# Altium schematic sheet Cell Characterization Board V1.1.SchDoc
size 431 x 279 mm; SheetNumber: 1; SheetTotal: 1
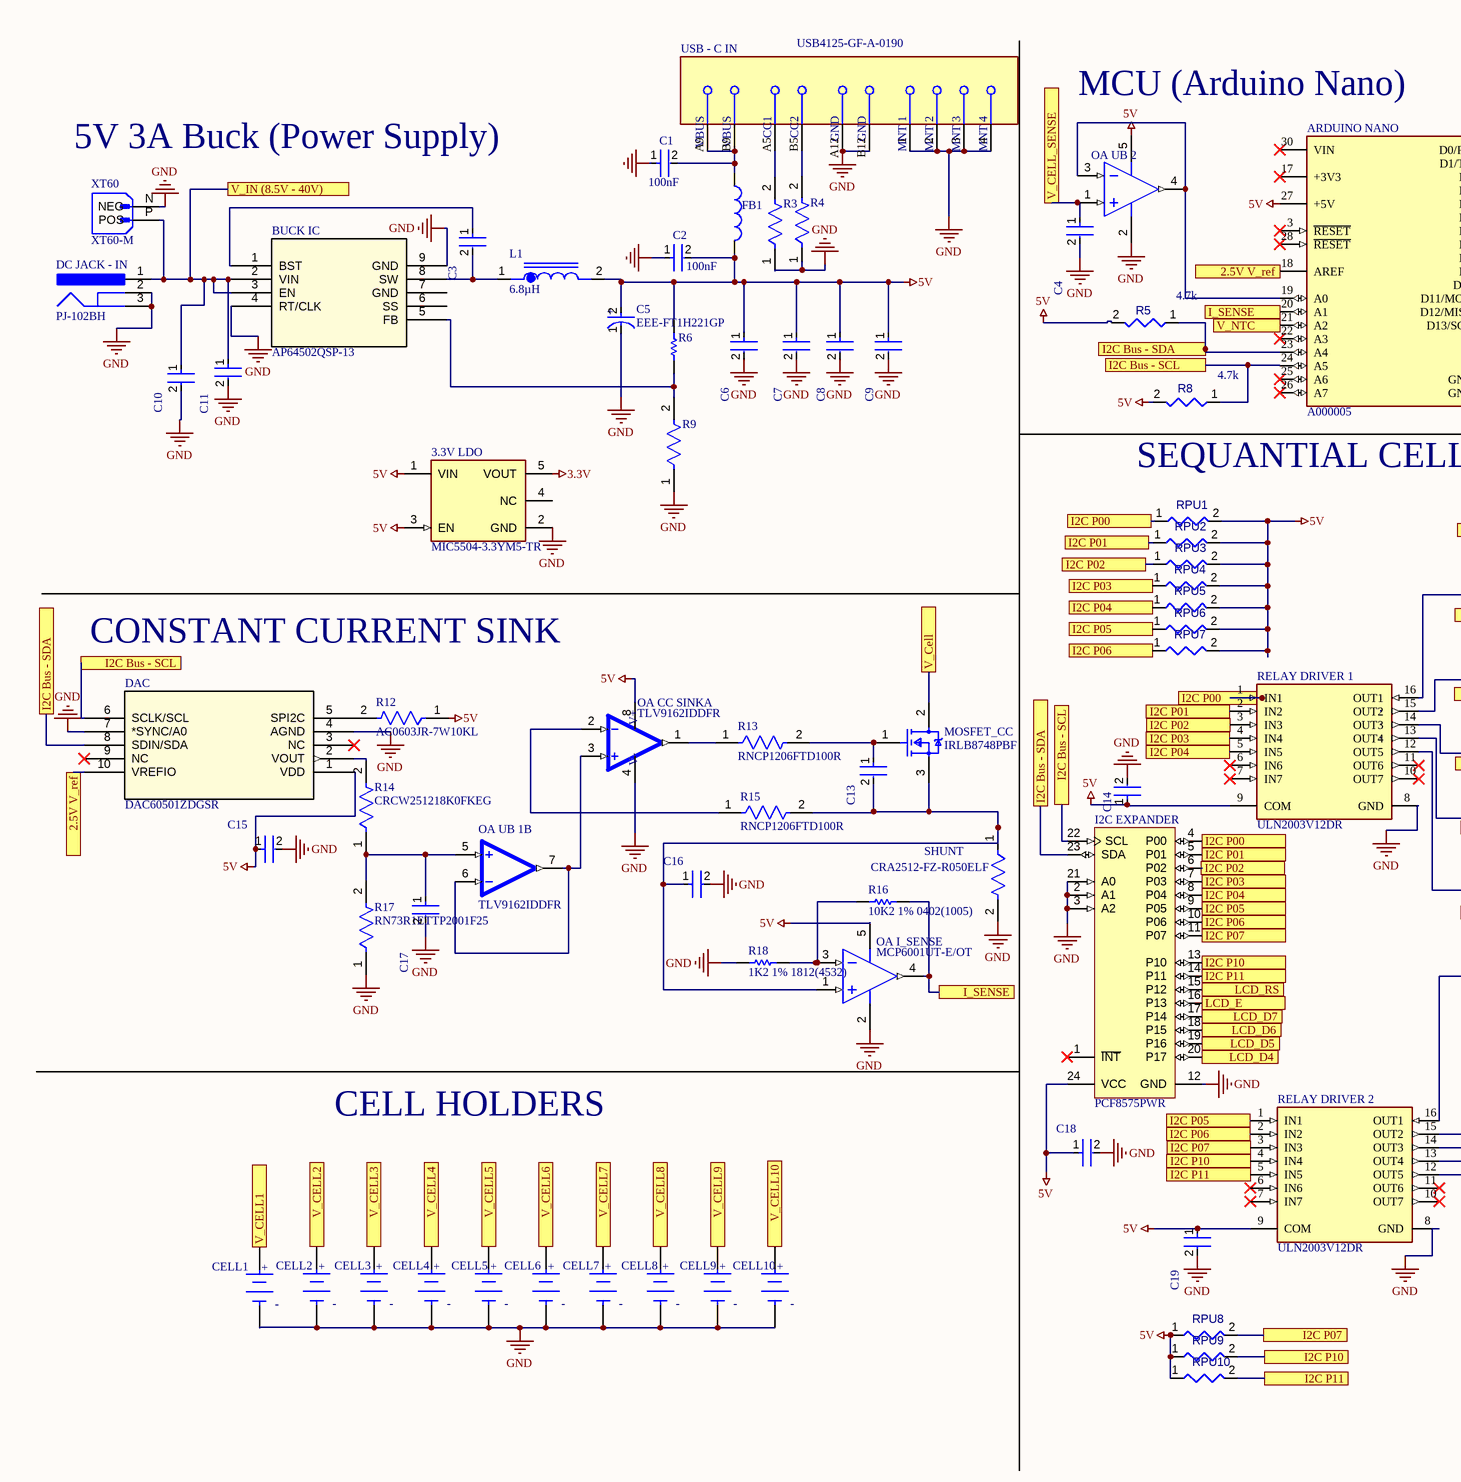
[diagram p0: Cell Characterization Board V1.1.SchDoc, top left]
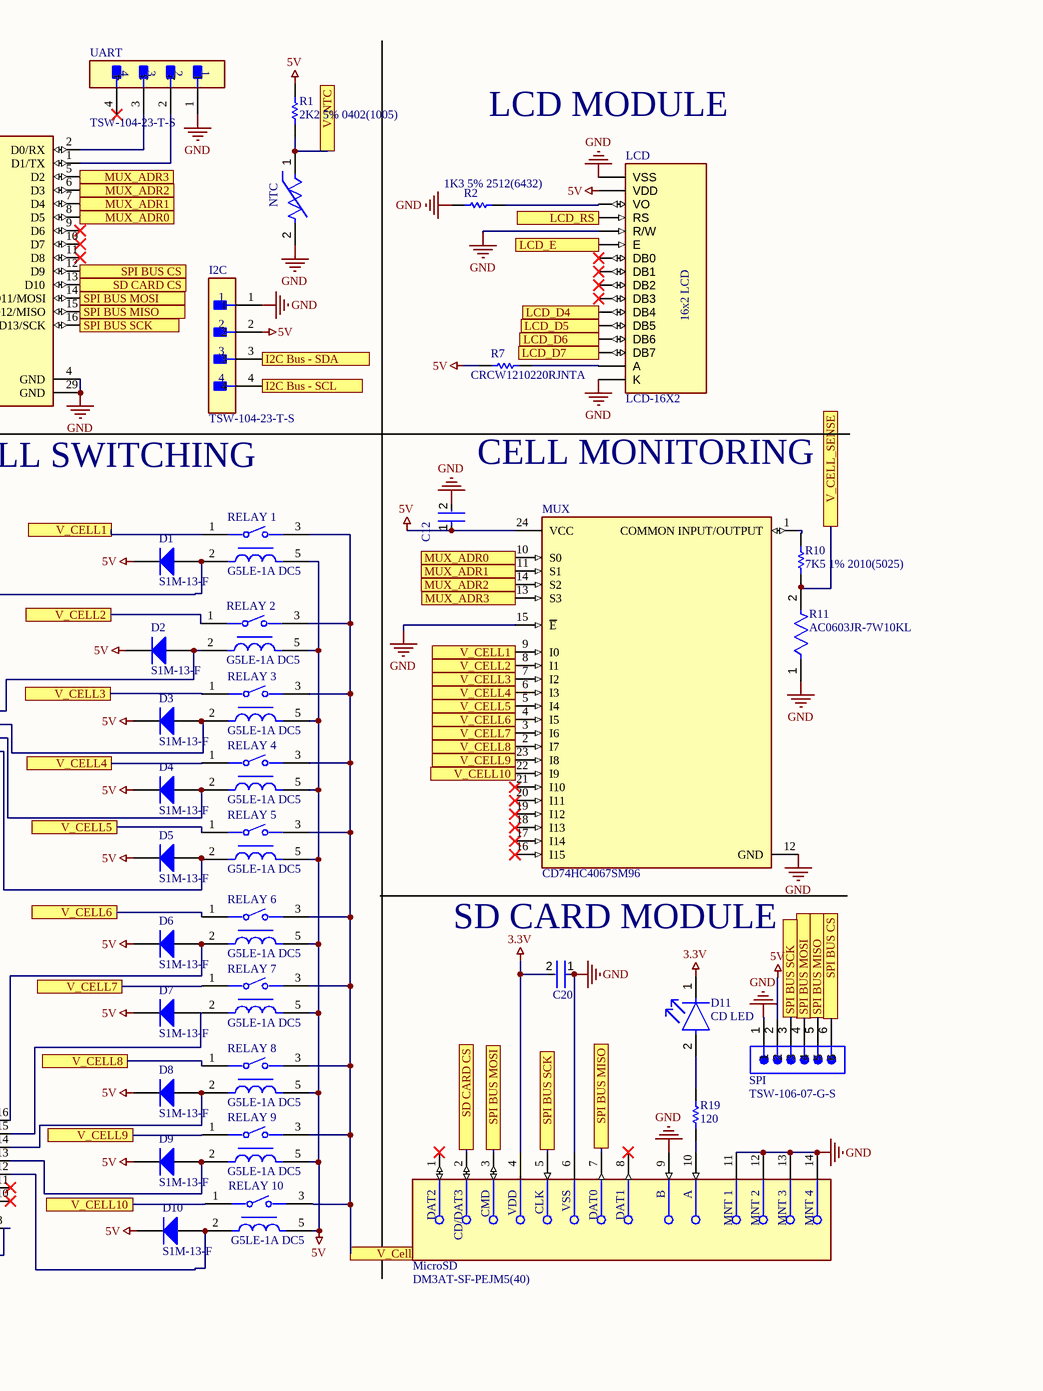
[diagram p1: Cell Characterization Board V1.1.SchDoc, top middle]

## Parts
3.3V_LDO  MIC5504-3.3YM5-TR  [FP-SOT23-5LD-PL-1-MFG]
ARDUINO_NANO  A000005  [FP-A000005-MFG]
BUCK_IC  AP64502QSP-13  [SO-8EP_DIO]
C1  100nF  [FP-CC0603-DA-MFG]
C2  100nF  [FP-CC0603-DA-MFG]
C3  CC0603KPX7R9BB104  [FP-CC0603-DA-MFG]  (value not drawn)
C4  CC0603KPX7R9BB104  [FP-CC0603-DA-MFG]  (value not drawn)
C5  EEE-FT1H221GP  [FP-FTF-MFG]
C6  GRM155R61H474KE11D  [FP-GRM155-0_1-IPC_B]  (value not drawn)
C7  GRM155R61H474KE11D  [FP-GRM155-0_1-IPC_B]  (value not drawn)
C8  GRM155R61H474KE11D  [FP-GRM155-0_1-IPC_B]  (value not drawn)
C9  GRM155R61H474KE11D  [FP-GRM155-0_1-IPC_B]  (value not drawn)
C10  CL31A106KBHNNNE  [FP-CL31-IPC_C]  (value not drawn)
C11  CL31A106KBHNNNE  [FP-CL31-IPC_C]  (value not drawn)
C12  CC0603KPX7R9BB104  [FP-CC0603-DA-MFG]  (value not drawn)
C13  C0402C103J3RACAUTO  [FP-C0402-BB-MFG]  (value not drawn)
C14  CC0603KPX7R9BB104  [FP-CC0603-DA-MFG]  (value not drawn)
C15  CC0603KPX7R9BB104  [FP-CC0603-DA-MFG]  (value not drawn)
C16  CC0603KPX7R9BB104  [FP-CC0603-DA-MFG]  (value not drawn)
C17  CC0603KPX7R9BB104  [FP-CC0603-DA-MFG]  (value not drawn)
C18  CC0603KPX7R9BB104  [FP-CC0603-DA-MFG]  (value not drawn)
C19  CC0603KPX7R9BB104  [FP-CC0603-DA-MFG]  (value not drawn)
C20  CC0603KPX7R9BB104  [FP-CC0603-DA-MFG]  (value not drawn)
CELL1  1042P  [FP-1042P-MFG]  (value not drawn)
CELL2  1042P  [FP-1042P-MFG]  (value not drawn)
CELL3  1042P  [FP-1042P-MFG]  (value not drawn)
CELL4  1042P  [FP-1042P-MFG]  (value not drawn)
CELL5  1042P  [FP-1042P-MFG]  (value not drawn)
CELL6  1042P  [FP-1042P-MFG]  (value not drawn)
CELL7  1042P  [FP-1042P-MFG]  (value not drawn)
CELL8  1042P  [FP-1042P-MFG]  (value not drawn)
CELL9  1042P  [FP-1042P-MFG]  (value not drawn)
CELL10  1042P  [FP-1042P-MFG]  (value not drawn)
D1  S1M-13-F  [DIOD-S1M-13-F-SMA-2_V]
D2  S1M-13-F  [DIOD-S1M-13-F-SMA-2_V]
D3  S1M-13-F  [DIOD-S1M-13-F-SMA-2_V]
D4  S1M-13-F  [DIOD-S1M-13-F-SMA-2_V]
D5  S1M-13-F  [DIOD-S1M-13-F-SMA-2_V]
D6  S1M-13-F  [DIOD-S1M-13-F-SMA-2_V]
D7  S1M-13-F  [DIOD-S1M-13-F-SMA-2_V]
D8  S1M-13-F  [DIOD-S1M-13-F-SMA-2_V]
D9  S1M-13-F  [DIOD-S1M-13-F-SMA-2_V]
D10  S1M-13-F  [DIOD-S1M-13-F-SMA-2_V]
D11  CD LED  [FP-LTST-C190GKT-MFG]
DAC  DAC60501ZDGSR  [DGS10_TEX]
DC_JACK_-_IN  PJ-102BH  [CUI-PJ-102BH_V]
FB1  74279252  [WE-CBF_1812_L4.5W3.2H1.5_HC]  (value not drawn)
I2C  TSW-104-23-T-S  [FP-TSW-104-23-T-S-MFG]
I2C_EXPANDER  PCF8575PWR  [PW0024A_L]
L1  value 6.8µH  [IND_MGAH06036R8M-10]  (hidden comment: MGAH06036R8M-10)
LCD  LCD-16X2  [MODULE_LCD-16X2]
MicroSD  DM3AT-SF-PEJM5(40)  [FP-DM3AT-SF-PEJM5_40-MFG]
MOSFET_CC  IRLB8748PBF  [FP-PG-TO220-3-MFG]
MUX  CD74HC4067SM96  [FP-DB0024A-IPC_C]
NTC  NXRT15XH103FA1B030  [FP-NXR_151B030-MFG]  (value not drawn)
OA_CC_SINK  TLV9162IDDFR  [SOT65P280X110-8N]  (part A of 2)
OA_I_SENSE  MCP6001UT-E/OT  [SOT-23-OT5_L]
OA_UB_1  TLV9162IDDFR  [SOT65P280X110-8N]  (part B of 2)
OA_UB_2  MCP6001UT-E/OT  [SOT-23-OT5_L]  (value not drawn)
R1  2K2 5% 0402(1005)  [RESC0402(1005)_N]
R2  1K3 5% 2512(6432)  [RESC2512(6432)_M]
R3  CPF0603B10K7E  [FP-CPF0603-MFG]  (value not drawn)
R4  CPF0603B10K7E  [FP-CPF0603-MFG]  (value not drawn)
R5  value 4.7k  [RESC1005X40X25ML05T05]  (hidden comment: Resistor 4k7 +/-1% 0402 100 mW)
R6  523K 1% 0805(2012)  [RESC0805(2012)_L]  (value not drawn)
R7  CRCW1210220RJNTA  [RESC3225X60X45NL20T20]
R8  value 4.7k  [RESC1005X40X25ML05T05]  (hidden comment: Resistor 4k7 +/-1% 0402 100 mW)
R9  AC0603JR-7W10KL  [FP-AC0603-IPC_A]  (value not drawn)
R10  7K5 1% 2010(5025)  [RESC2010(5025)_M]
R11  AC0603JR-7W10KL  [FP-AC0603-IPC_A]
R12  AC0603JR-7W10KL  [FP-AC0603-IPC_A]
R13  RNCP1206FTD100R  [FP-RNCP1206-IPC_C]
R14  CRCW251218K0FKEG  [FP-CRCW2512-e3-MFG]
R15  RNCP1206FTD100R  [FP-RNCP1206-IPC_C]
R16  10K2 1% 0402(1005)  [RESC0402(1005)_N]
R17  RN73R1ETTP2001F25  [FP-RN73R1E-IPC_B]
R18  1K2 1% 1812(4532)  [RESC1812(4532)_L]
R19  120  [RESC3225X60X45NL20T20]
RELAY_1  G5LE-1A DC5  [FP-G5LE-1A_DC5-MFG]
RELAY_2  G5LE-1A DC5  [FP-G5LE-1A_DC5-MFG]
RELAY_3  G5LE-1A DC5  [FP-G5LE-1A_DC5-MFG]
RELAY_4  G5LE-1A DC5  [FP-G5LE-1A_DC5-MFG]
RELAY_5  G5LE-1A DC5  [FP-G5LE-1A_DC5-MFG]
RELAY_6  G5LE-1A DC5  [FP-G5LE-1A_DC5-MFG]
RELAY_7  G5LE-1A DC5  [FP-G5LE-1A_DC5-MFG]
RELAY_8  G5LE-1A DC5  [FP-G5LE-1A_DC5-MFG]
RELAY_9  G5LE-1A DC5  [FP-G5LE-1A_DC5-MFG]
RELAY_10  G5LE-1A DC5  [FP-G5LE-1A_DC5-MFG]
RELAY_DRIVER_1  ULN2003V12DR  [FP-D0016A-MFG]
RELAY_DRIVER_2  ULN2003V12DR  [FP-D0016A-MFG]
RPU1  Resistor 4k7 +/-1% 0402 100 mW  [RESC1005X40X25ML05T05]  (value not drawn)
RPU2  Resistor 4k7 +/-1% 0402 100 mW  [RESC1005X40X25ML05T05]  (value not drawn)
RPU3  Resistor 4k7 +/-1% 0402 100 mW  [RESC1005X40X25ML05T05]  (value not drawn)
RPU4  Resistor 4k7 +/-1% 0402 100 mW  [RESC1005X40X25ML05T05]  (value not drawn)
RPU5  Resistor 4k7 +/-1% 0402 100 mW  [RESC1005X40X25ML05T05]  (value not drawn)
RPU6  Resistor 4k7 +/-1% 0402 100 mW  [RESC1005X40X25ML05T05]  (value not drawn)
RPU7  Resistor 4k7 +/-1% 0402 100 mW  [RESC1005X40X25ML05T05]  (value not drawn)
RPU8  Resistor 4k7 +/-1% 0402 100 mW  [RESC1005X40X25ML05T05]  (value not drawn)
RPU9  Resistor 4k7 +/-1% 0402 100 mW  [RESC1005X40X25ML05T05]  (value not drawn)
RPU10  Resistor 4k7 +/-1% 0402 100 mW  [RESC1005X40X25ML05T05]  (value not drawn)
SHUNT  CRA2512-FZ-R050ELF  [FP-CRA2512-IPC_A]
SPI  TSW-106-07-G-S  [SMTC-TSW-106-07-X-S]
UART  TSW-104-23-T-S  [FP-TSW-104-23-T-S-MFG]
USB_-_C_IN  USB4125-GF-A-0190  [FP-USB4125-GF-A-0190-MFG]
XT60  XT60-M  [AMASS_XT60-M]

## Ports
2.5V V_ref, I2C Bus - SCL, I2C Bus - SDA, I2C P00, I2C P01, I2C P02, I2C P03, I2C P04, I2C P05, I2C P06, I2C P07, I2C P10, I2C P11, I_SENSE, LCD_D4, LCD_D5, LCD_D6, LCD_D7, LCD_E, LCD_RS, MUX_ADR0, MUX_ADR1, MUX_ADR2, MUX_ADR3, SD CARD CS, SPI BUS CS, SPI BUS MISO, SPI BUS MOSI, SPI BUS SCK, V_Cell, V_CELL1, V_CELL2, V_CELL3, V_CELL4, V_CELL5, V_CELL6, V_CELL7, V_CELL8, V_CELL9, V_CELL10, V_CELL_SENSE, V_IN (8.5V - 40V), V_NTC

## Nets
3.3V: 3.3V_LDO.5(VOUT) C20.2 D11.1(C) MicroSD.4(VDD)
5V: 3.3V_LDO.1(VIN) 3.3V_LDO.3(EN) ARDUINO_NANO.27(+5V) C2.2 C5.2(A) C6.1 C7.1 C8.1 C9.1 C12.1 C14.1 C15.1 C18.1 C19.1 D1.2(K) D2.2(K) D3.2(K) D4.2(K) D5.2(K) D6.2(K) D7.2(K) D8.2(K) D9.2(K) D10.2(K) DAC.1(VDD) FB1.2 I2C.2 I2C_EXPANDER.24(VCC) L1.2 LCD.2(VDD) MUX.24(VCC) OA_CC_SINK.8(V+) OA_I_SENSE.5(VDD) OA_UB_2.5(VDD) R1.2 R5.2 R6.2 R7.1 R8.2 R12.1 RELAY_1.5 RELAY_2.5 RELAY_3.5 RELAY_4.5 RELAY_5.5 RELAY_6.5 RELAY_7.5 RELAY_8.5 RELAY_9.5 RELAY_10.5 RELAY_DRIVER_1.9(COM) RELAY_DRIVER_2.9(COM) RPU1.2 RPU2.2 RPU3.2 RPU4.2 RPU5.2 RPU6.2 RPU7.2 RPU8.1 RPU9.1 RPU10.1 SPI.2
GND: 3.3V_LDO.2(GND) ARDUINO_NANO.4(GND) ARDUINO_NANO.29(GND) BUCK_IC.4(RT/CLK) BUCK_IC.9(GND) C1.1 C2.1 C4.2 C5.1(C) C6.2 C7.2 C8.2 C9.2 C10.2 C11.2 C12.2 C14.2 C15.2 C16.2 C17.2 C18.2 C19.2 C20.1 CELL1.1(C) CELL2.1(C) CELL3.1(C) CELL4.1(C) CELL5.1(C) CELL6.1(C) CELL7.1(C) CELL8.1(C) CELL9.1(C) CELL10.1(C) DAC.4(AGND) DAC.7(*SYNC/A0) DC_JACK_-_IN.2 DC_JACK_-_IN.3 I2C.1 I2C_EXPANDER.2(A1) I2C_EXPANDER.3(A2) I2C_EXPANDER.12(GND) I2C_EXPANDER.21(A0) LCD.1(VSS) LCD.5(R/W) LCD.16(K) MicroSD.6(VSS) MicroSD.9(B) MicroSD.11(MNT_1) MicroSD.12(MNT_2) MicroSD.13(MNT_3) MicroSD.14(MNT_4) MUX.12(GND) MUX.15(~{E}) NTC.2 OA_CC_SINK.4(V-) OA_I_SENSE.2(VSS) OA_UB_2.2(VSS) R2.1 R3.1 R4.1 R9.1 R11.1 R17.1 R18.1 RELAY_DRIVER_1.8(GND) RELAY_DRIVER_2.8(GND) SHUNT.2 SPI.1 UART.1 USB_-_C_IN.1(MNT_1) USB_-_C_IN.2(MNT_2) USB_-_C_IN.3(MNT_3) USB_-_C_IN.4(MNT_4) USB_-_C_IN.A12(GND) USB_-_C_IN.B12(GND) XT60.N(NEG)
2.5V V_ref: ARDUINO_NANO.18(AREF) DAC.10(VREFIO) ; port 2.5V V_ref
I2C Bus - SCL: ARDUINO_NANO.24(A5) DAC.6(SCLK/SCL) I2C.4 I2C_EXPANDER.22(SCL) R8.1 ; port I2C Bus - SCL
I2C Bus - SDA: ARDUINO_NANO.23(A4) DAC.8(SDIN/SDA) I2C.3 I2C_EXPANDER.23(SDA) R5.1 ; port I2C Bus - SDA
I2C P00: I2C_EXPANDER.4(P00) RELAY_DRIVER_1.1(IN1) RPU1.1 ; port I2C P00
I2C P01: I2C_EXPANDER.5(P01) RELAY_DRIVER_1.2(IN2) RPU2.1 ; port I2C P01
I2C P02: I2C_EXPANDER.6(P02) RELAY_DRIVER_1.3(IN3) RPU3.1 ; port I2C P02
I2C P03: I2C_EXPANDER.7(P03) RELAY_DRIVER_1.4(IN4) RPU4.1 ; port I2C P03
I2C P04: I2C_EXPANDER.8(P04) RELAY_DRIVER_1.5(IN5) RPU5.1 ; port I2C P04
I2C P05: I2C_EXPANDER.9(P05) RELAY_DRIVER_2.1(IN1) RPU6.1 ; port I2C P05
I2C P06: I2C_EXPANDER.10(P06) RELAY_DRIVER_2.2(IN2) RPU7.1 ; port I2C P06
I2C P07: I2C_EXPANDER.11(P07) RELAY_DRIVER_2.3(IN3) RPU8.2 ; port I2C P07
I2C P10: I2C_EXPANDER.13(P10) RELAY_DRIVER_2.4(IN4) RPU9.2 ; port I2C P10
I2C P11: I2C_EXPANDER.14(P11) RELAY_DRIVER_2.5(IN5) RPU10.2 ; port I2C P11
I_SENSE: ARDUINO_NANO.20(A1) OA_I_SENSE.4(VOUT) R16.2 ; port I_SENSE
LCD_D4: I2C_EXPANDER.20(P17) LCD.11(DB4) ; port LCD_D4
LCD_D5: I2C_EXPANDER.19(P16) LCD.12(DB5) ; port LCD_D5
LCD_D6: I2C_EXPANDER.18(P15) LCD.13(DB6) ; port LCD_D6
LCD_D7: I2C_EXPANDER.17(P14) LCD.14(DB7) ; port LCD_D7
LCD_E: I2C_EXPANDER.16(P13) LCD.6(E) ; port LCD_E
LCD_RS: I2C_EXPANDER.15(P12) LCD.4(RS) ; port LCD_RS
MUX_ADR0: ARDUINO_NANO.8(D5) MUX.10(S0) ; port MUX_ADR0
MUX_ADR1: ARDUINO_NANO.7(D4) MUX.11(S1) ; port MUX_ADR1
MUX_ADR2: ARDUINO_NANO.6(D3) MUX.14(S2) ; port MUX_ADR2
MUX_ADR3: ARDUINO_NANO.5(D2) MUX.13(S3) ; port MUX_ADR3
SD CARD CS: ARDUINO_NANO.13(D10) MicroSD.2(CD/DAT3) ; port SD CARD CS
SPI BUS CS: ARDUINO_NANO.12(D9) SPI.6 ; port SPI BUS CS
SPI BUS MISO: ARDUINO_NANO.15(D12/MISO) MicroSD.7(DAT0) SPI.5 ; port SPI BUS MISO
SPI BUS MOSI: ARDUINO_NANO.14(D11/MOSI) MicroSD.3(CMD) SPI.4 ; port SPI BUS MOSI
SPI BUS SCK: ARDUINO_NANO.16(D13/SCK) MicroSD.5(CLK) SPI.3 ; port SPI BUS SCK
V_Cell: MOSFET_CC.2(D) RELAY_1.3 RELAY_2.3 RELAY_3.3 RELAY_4.3 RELAY_5.3 RELAY_6.3 RELAY_7.3 RELAY_8.3 RELAY_9.3 RELAY_10.3 ; port V_Cell
V_CELL1: CELL1.2(A) MUX.9(I0) RELAY_1.1 ; port V_CELL1
V_CELL2: CELL2.2(A) MUX.8(I1) RELAY_2.1 ; port V_CELL2
V_CELL3: CELL3.2(A) MUX.7(I2) RELAY_3.1 ; port V_CELL3
V_CELL4: CELL4.2(A) MUX.6(I3) RELAY_4.1 ; port V_CELL4
V_CELL5: CELL5.2(A) MUX.5(I4) RELAY_5.1 ; port V_CELL5
V_CELL6: CELL6.2(A) MUX.4(I5) RELAY_6.1 ; port V_CELL6
V_CELL7: CELL7.2(A) MUX.3(I6) RELAY_7.1 ; port V_CELL7
V_CELL8: CELL8.2(A) MUX.2(I7) RELAY_8.1 ; port V_CELL8
V_CELL9: CELL9.2(A) MUX.23(I8) RELAY_9.1 ; port V_CELL9
V_CELL10: CELL10.2(A) MUX.22(I9) RELAY_10.1 ; port V_CELL10
V_CELL_SENSE: C4.1 OA_UB_2.1(VIN+) R10.1 R11.2 ; port V_CELL_SENSE
V_IN (8.5V - 40V): BUCK_IC.2(VIN) BUCK_IC.3(EN) C10.1 C11.1 DC_JACK_-_IN.1 XT60.P(POS) ; port V_IN (8.5V - 40V)
V_NTC: ARDUINO_NANO.21(A2) NTC.1 R1.1 ; port V_NTC
NetARDUINO_NANO_1: ARDUINO_NANO.1(D1/TX) UART.2
NetARDUINO_NANO_2: ARDUINO_NANO.2(D0/RX) UART.3
NetARDUINO_NANO_19: ARDUINO_NANO.19(A0) OA_UB_2.3(VIN-) OA_UB_2.4(VOUT)
NetBUCK_IC_1: BUCK_IC.1(BST) C3.1
NetBUCK_IC_5: BUCK_IC.5(FB) R6.1 R9.2
NetBUCK_IC_8: BUCK_IC.8(SW) C3.2 L1.1
NetC1_2: C1.2 FB1.1 USB_-_C_IN.A9(VBUS) USB_-_C_IN.B9(VBUS)
NetC13_1: C13.1 MOSFET_CC.1(G) R13.2
NetC13_2: C13.2 C16.1 MOSFET_CC.3(S) OA_I_SENSE.1(VIN+) R15.2 SHUNT.1
NetC17_1: C17.1 OA_UB_1.5(IN2+) R14.1 R17.2
NetD1_1: D1.1(A) RELAY_1.2 RELAY_DRIVER_1.16(OUT1)
NetD2_1: D2.1(A) RELAY_2.2 RELAY_DRIVER_1.15(OUT2)
NetD3_1: D3.1(A) RELAY_3.2 RELAY_DRIVER_1.14(OUT3)
NetD4_1: D4.1(A) RELAY_4.2 RELAY_DRIVER_1.13(OUT4)
NetD5_1: D5.1(A) RELAY_5.2 RELAY_DRIVER_1.12(OUT5)
NetD6_1: D6.1(A) RELAY_6.2 RELAY_DRIVER_2.16(OUT1)
NetD7_1: D7.1(A) RELAY_7.2 RELAY_DRIVER_2.15(OUT2)
NetD8_1: D8.1(A) RELAY_8.2 RELAY_DRIVER_2.14(OUT3)
NetD9_1: D9.1(A) RELAY_9.2 RELAY_DRIVER_2.13(OUT4)
NetD10_1: D10.1(A) RELAY_10.2 RELAY_DRIVER_2.12(OUT5)
NetD11_2: D11.2(A) R19.2
NetDAC_2: DAC.2(VOUT) R14.2
NetDAC_5: DAC.5(SPI2C) R12.2
NetLCD_3: LCD.3(VO) R2.2
NetLCD_15: LCD.15(A) R7.2
NetMicroSD_10: MicroSD.10(A) R19.1
NetMUX_1: MUX.1(COMMON_INPUT/OUTPUT) R10.2
NetOA_CC_SINK_1: OA_CC_SINK.1(OUT1) R13.1
NetOA_CC_SINK_2: OA_CC_SINK.2(IN1-) R15.1
NetOA_CC_SINK_3: OA_CC_SINK.3(IN1+) OA_UB_1.6(IN2-) OA_UB_1.7(OUT2)
NetOA_I_SENSE_3: OA_I_SENSE.3(VIN-) R16.1 R18.2
NetR3_2: R3.2 USB_-_C_IN.A5(CC1)
NetR4_2: R4.2 USB_-_C_IN.B5(CC2)

Not connected (* = marked no-connect by the designer): 3.3V_LDO 4(NC); ARDUINO_NANO 3(~{RESET})* 9(D6)* 10(D7)* 11(D8)* 17(+3V3)* 22(A3)* 25(A6)* 26(A7)* 28(~{RESET})* 30(VIN)*; BUCK_IC 6(SS) 7(GND); DAC 3(NC)* 9(NC)*; I2C_EXPANDER 1(~{INT})*; LCD 7(DB0)* 8(DB1)* 9(DB2)* 10(DB3)*; MicroSD 1(DAT2)* 8(DAT1)*; MUX 16(I15)* 17(I14)* 18(I13)* 19(I12)* 20(I11)* 21(I10)*; RELAY_DRIVER_1 6(IN6)* 7(IN7)* 10(OUT7)* 11(OUT6)*; RELAY_DRIVER_2 6(IN6)* 7(IN7)* 10(OUT7)* 11(OUT6)*; UART 4*

## Notes on the sheet
- MCU (Arduino Nano)
- (near XT60) 5V 3A Buck (Power Supply)
- LCD MODULE
- SEQUANTIAL CELL SWITCHING
- CELL MONITORING
- CONSTANT CURRENT SINK
- SD CARD MODULE
- CELL HOLDERS
- DWG. NO.
- REV.
- SHT.
- THIS DOCUMENT AND THE DATA DISCLOSED HEREIN OR HEREWITH IS THE PROPERTY OF ALTIUM LIMITED AND MAY BE FREELY DISTRIBUTED IN WHOLE. NO RIGHTS ARE RESERVED OR EXPRESS OR IMPLIED WARANTEE GIVEN.
- REVISION
- DESCRIPTION
- DATE
- APPROVED
- ENG:
- APPROVALS
- PROJECT
- DSN:
- CHK:
- REFERENCE DOCUMENTS
- PROJECT REVISION:
- TITLE
- DOCUMENT REVISION:
- DESIGN ITEM:
- BOM:
- FAB DWG:
- PCB DWG:
- ASSY DWG:
- SCALE:
- SIZE
- B
- CAGE CODE
- FILE NAME
- DWG NO.
- SHEET
- OF
- REV
- (in symbol CMP-008-000000-1) 16x2 LCD
- (in symbol CMP-05427-002180-1) +
- (in symbol CMP-19636-000019-1) +; -

## Library data of the parts
3.3V_LDO = CMP-2000-07604-2: IC REG LINEAR 3.3V 300MA SOT23-5; Quiescent Current: 38uA; Operating Supply Current: 42uA; Max Input Voltage: 5.5V; Min Input Voltage: 2.5V; Output Type: Fixed; Power Supply Rejection Ratio (PSRR): 60dB; Dropout Voltage: 380mV; Accuracy: 3%; Number of Outputs: 1; Nominal Output Voltage: 3.3V; Max Output Current: 300mA; Length: 2.9mm; Mount: Surface Mount; Width: 1.6mm; Packaging: Tape and Reel; Output Current: 300mA; Min Operating Temperature: -40°C; Max Operating Temperature: 125°C; Height: 1.1mm; Case/Package: SOT-23-5; REACH SVHC: No SVHC; Number of Pins: 5; Output Voltage: 3.3V
ARDUINO_NANO = CMP-189986-000002-1: ARDUINO NANO ATMEGA328 EVAL BRD; Number of Bits: 8; Evaluation Kit: Yes; Operating Supply Voltage: 12V; Interface: I2C; Data Bus Width: 8b; Core Architecture: AVR; Packaging: Bulk; Length: 7inch; Package Quantity: 50; Width: 5inch; REACH SVHC: No SVHC; Weight: 0.358383oz; Series: AVR® ATmega; Height: 0.25inch
BUCK_IC = AP64502QSP-13: Description; Manufacturer_Name: Diodes Inc; Copyright: Copyright (C) 2025 Ultra Librarian. All rights reserved.; Manufacturer_Part_Number: AP64502QSP-13; RefDes: RefDes; Type: Type
C1 C2 = CMP-03422-000468-1: CAP CER 0.1UF 50V X7R 0603; Manufacturer: YAGEO; Manufacturer Part Number: CC0603KPX7R9BB104; Temperature Coefficient: 15%; Material: Ceramic; Tolerance: 0.1; Device Class L1: Passive Components; Temperature Range High: +125°C; ComponentLink2Description: Datasheet; Temperature Characteristic: X7R; Octopart: https://octopart.com/cc0603kpx7r9bb104-yageo-12885113; Height: 0.9mm; Mouser Description: Multilayer Ceramic Capacitors MLCC - SMD/SMT 100nF 50V X7R 10%; Device Class L3: Ceramic Capacitors; Voltage Rating: 50 V; Device Class L2: Capacitors; ComponentLink2URL: http://www.yageo.com/documents/recent/UPY-GPHC_X7R_6.3V-to-50V_18.pdf; Package: CC0603-DA; Automotive: No; Capacitance: 100 nF; Voltage: 50 V; RoHS: TRUE; Lead Free: Yes; Digikey Description: CAP CER 0.1UF 50V X7R 0603; Footprint Url: http://www.yageo.com/exep/pages/download/literatures/UPY-C_GEN_24.pdf; Temperature Range Low: -55°C; Temperature: -55°C to +125°C; Value: 100 nF; Category: Cap
C3 C4 C12 C14-C20 = CMP-03422-000468-1: CAP CER 0.1UF 50V X7R 0603; Manufacturer: YAGEO; Temperature Coefficient: 15%; Capacitance: 100 nF; Material: Ceramic; Value: 100 nF; Tolerance: 0.1; Device Class L1: Passive Components; Temperature Range High: +125°C; ComponentLink2Description: Datasheet; Temperature Characteristic: X7R; Octopart: https://octopart.com/cc0603kpx7r9bb104-yageo-12885113; Height: 0.9mm; Mouser Description: Multilayer Ceramic Capacitors MLCC - SMD/SMT 100nF 50V X7R 10%; Device Class L3: Ceramic Capacitors; Voltage Rating: 50 V; Device Class L2: Capacitors; ComponentLink2URL: http://www.yageo.com/documents/recent/UPY-GPHC_X7R_6.3V-to-50V_18.pdf; Package: CC0603-DA; Manufacturer Part Number: CC0603KPX7R9BB104; Automotive: No; Voltage: 50 V; RoHS: TRUE; Lead Free: Yes; Digikey Description: CAP CER 0.1UF 50V X7R 0603; Footprint Url: http://www.yageo.com/exep/pages/download/literatures/UPY-C_GEN_24.pdf; Temperature Range Low: -55°C; Temperature: -55°C to +125°C; Category: Cap
C5 = CMP-05427-002180-1: CAP ALUM 220UF 20% 50V SMD; Ripple Current: 435.5mA; Polarity: Polar; ESR (Equivalent Series Resistance): 180mR; Ripple Current (AC): 670mA; Life (Hours): 5000Hour; Mount: Surface Mount; Height: 10.2mm; Voltage Rating: 50V; RoHS Compliant: Yes; Packaging: Cut Tape; Capacitance: 220uF; Height - Seated (Max): 0.413inch; Tolerance: 20%; Diameter: 8mm; Case/Package: Radial; Max Operating Temperature: 105°C; Min Operating Temperature: -55°C; Voltage Rating (DC): 50V; Reach SVHC Compliant: Yes
C6-C9 = CMP-06035-008741-1: Chip Multilayer Ceramic Capacitors for General Purpose, 0402, 0.47uF, X5R, 15%, 10%, 50V; Capacitance: 470nF; Dielectric: X5R; Voltage Rating (DC): 50V; Width: 500um; Tolerance: 10%; Length: 1mm; Thickness: 500um
C10 C11 = CMP-13271-000016-1: CAP CER 10UF 50V X5R 1206; Manufacturer: Samsung; Tolerance: 10%; Material: Ceramic; Temperature Coefficient: 15%; RoHS: TRUE; Ipc Land Pattern Name: CAPC320160X160; Temperature Range Low: -55°C; Value: 10uF; Device Class L3: Ceramic Capacitors; Category: Cap; Temperature Characteristic: X5R; Lead Free: Yes; Device Class L2: Capacitors; Octopart: https://octopart.com/cl31a106kbhnnne-samsung-19832778; ComponentLink2Description: Datasheet; Digikey Description: CAP CER 10UF 50V X5R 1206; Voltage: 50V; ComponentLink2URL: http://www.samsungsem.com/kr/support/product-search/mlcc/__icsFiles/afieldfile/2018/06/21/CL31A106KBHNNNE.pdf; Capacitance: 10uF; Manufacturer Part Number: CL31A106KBHNNNE; Temperature Range High: +85°C; Device Class L1: Passive Components; Height: 1.8mm; Automotive: No; Voltage Rating: 50V; Package: CL31; Temperature: -55°C to +85°C
C13 = CMP-03020-001805-1: C0402 10,000 pF X7R 5.00% 25 V; Manufacturer: Kemet; Voltage Rating: 25 V; Temperature Coefficient: 15%; Tolerance: 0.05; Material: Ceramic; Category: Cap; Value: 10,000 pF; Ipc Land Pattern Name: CAPC10050X50; Mouser Description: Cap Ceramic 0.01uF 25V X7R 5% SMD 0402 125°C Paper T/R; Automotive: No; Lead Free: Yes; RoHS: TRUE; Height: 0.55mm; Device Class L1: Passive Components; Capacitance: 10,000 pF; Temperature: -55°C to +125°C; Manufacturer Part Number: C0402C103J3RACAUTO; Device Class L3: Ceramic Capacitors; Octopart: https://octopart.com/c0402c103j3racauto-kemet-95437015; ComponentLink2Description: Datasheet; Device Class L2: Capacitors; Temperature Characteristic: X7R; Temperature Range High: +125°C; Package: C0402-BB; ComponentLink2URL: https://content.kemet.com/datasheets/KEM_C1002_X7R_SMD.pdf; Temperature Range Low: -55°C
CELL1-CELL10 = CMP-19636-000019-1: BATTERY HOLDER 18650 SMD TAB; Number of Cells: 1; Max Operating Temperature: 145°C; Termination: SMD/SMT; Mount: Surface Mount; Min Operating Temperature: -50°C; Package Quantity: 200; Packaging: Tray; Lead Free: Lead Free
D1-D10 = CMP-0639-00001-1: Surface Mount Glass Passivated Rectifier, 1000V, 1 A, -65 to 125 degC, 2-Pin SMA Package, RoHS, Tape and Reel; Manufacturer: Diodes Inc; Maximum Reverse Current IR (uA): 5; Maximum Peak Forward Surge Current IFSM (A): 30; Maximum Average Rectified Current IO (A): 1; Peak Repetitive Reverse Voltage VRRM (V): 1000; Total Capacitance CT (pF): 10; Forward Voltage Drop VF (V): 1.1; ComponentLink1URL: http://www.diodes.com/; Operating Temperature Range: -65 to 150 degC; ComponentLink3URL: http://diodes.com/datasheets/ds16003.pdf; ComponentLink3Description: Package Specification; PackageDescription: 2-Pin SMD, Body 4.3 x 2.605 mm, Height 2.3 mm; Mounting Technology: Surface Mount; ComponentLink1Description: Manufacturer URL; PackageReference: S1M-13-F-SMA-2; ComponentLink2URL: http://diodes.com/datasheets/ds16003.pdf; ComponentLink2Description: Datasheet; RoHS: TRUE; DatasheetVersion: Rev. 22 - 2; Packing: Tape and Reel; PackageVersion: Rev. 22 - 2; PartNumber: S1M-13-F
D11 = CMP-22017-000005-2: LED GREEN CLEAR CHIP SMD; Dominant Wavelength: 569nm; Reverse Voltage: 5V; Lens Color: Colorless; Viewing Angle: 130°; Voltage: 2V; Forward Current: 30mA; Power Dissipation: 100mW; Luminous Intensity: 6mcd; Number of LEDs: 1; Forward Voltage: 2.1V; Wavelength: 565nm; Test Current: 10mA; Min Operating Temperature: -55°C; Lens Style: Clear; Mount: Surface Mount; Width: 0.8mm; Packaging: Tape and Reel; Lens Transparency: Clear; Case Code (Metric): 1608; Depth: 0.8mm; Case Code (Imperial): 0603; Case/Package: 0603; Number of Pins: 2; Max Operating Temperature: 85°C; Lead Free: Lead Free; Number of Elements: 1; Length: 1.6mm; Height: 0.8mm; Package Quantity: 1; Power Rating: 100mW; Radiation Hardening: No; Illumination Color: Green; Color: Green
DAC = DAC60501ZDGSR: True 12-bit, 1-ch, SPI/I2C, voltage-output DAC in WSON package with precision internal reference 10-VSSOP -40 to 125; Manufacturer_Name: Texas Instruments; Copyright: Copyright (C) 2025 Ultra Librarian. All rights reserved.; Manufacturer_Part_Number: DAC60501ZDGSR; RefDes: RefDes; Type: Type
DC_JACK_-_IN = CMP-2000-06901-1: Through Hole Right Angle DC Power Jack, 5 A, 2.5 mm Center Pin, 3 Position, -25 to 85 degC, RoHS, Bulk; Manufacturer: CUIInc.; Outside Contact Diameter: 6.5mm; Current Rating: 5A; Brand: CUI; Insulation Resistance: 100MOhms; Inside Contact Diameter: 2.5mm; Voltage Rating: 24V; Operating Temperature Range: -25Cto+85C; Mounting Angle: Right; Mounting Technology: ThroughHole; Product Category: DCPowerConnectors; Datasheet Version: Rev. 1.02, 05/2016; Connector Type: DCPowerJack; Contact Material: Copper; Housing Material: PolybutyleneTerephthalate(PBT); Mounting Style: ThroughHole; Product: Jacks; Package Reference: PJ-102BH; Manufacturer URL: http://www.cui.com/; RoHS: True; Contact Gender: Male; Contact Plating: Nickel; Flammability Rating: UL94V-0; Factory Pack Quantity: 280; Datasheet URL: http://www.cui.com/product/resource/pj-102bh.pdf; Package Description: 3-Pin Through Hole Device, Body 14.4 x 9 mm, Height 11 mm; Termination Style: ThroughHole
FB1 = CMP-0220-00090-2: NexarPartId: 22803153; Resistance: 35mΩ; Impedance: 680Ω; Current Rating: 4A; Length: 4.5mm; Max Operating Temperature: 125°C; RoHS: Compliant; Packaging: Cut Tape; Height: 1.5mm; Min Operating Temperature: -55°C; Width: 3.2mm
I2C UART = CMP-02766-001388-1: CONN HEADER VERT 4POS 2.54MM; Number of Contacts: 4; Gender: Male; Connector Type: Male Pin; Max Voltage Rating (AC): 550V; Max Current Rating: 7.6A; Radiation Hardening: No; Lead Free: Lead Free; RoHS Compliant: Yes; Contact Material: Bronze; Number of Positions: 4; Housing Color: Black; Min Operating Temperature: -55°C; Mount: Through Hole; Number of Rows: 1; Orientation: Straight; Contact Mating Length: 0.23inch; Contact Type: Male Pin; REACH SVHC: No SVHC; Max Operating Temperature: 105°C; Color: Black; Pitch: 2.54mm; Length: 10.16mm; Series: TSW; Packaging: Bulk; Contact Plating: Tin; Package Quantity: 1; Termination: Solder; Housing Material: Polyester; Width: 2.54mm; Depth: 2.54mm
I2C_EXPANDER = CMP-0314-00318-2: Remote 16-Bit I2C and SMBus I/O Expander with Interrupt Output, 2.5 to 5.5 V, -40 to 85 degC, 24-pin TSSOP (PW), Green (RoHS & no Sb/Br); Manufacturer: Texas Instruments; SubFamily: I2C IO Expander; VCC(Min)(V): 2.5; I2C Address: 0100 xxx; # of I/Os: 16; Interrupt Output: Yes; Max Frequency(kHz): 400; fSCLK(Max)(MHz): 0.4; Voltage Nodes(V): 5.5, 3.6, 2.7, 2.5; VCC(Max)(V): 5.5; Code_JEDEC: MO-153; ComponentLink2URL: http://www.ti.com/litv/pdf/mpds177g; PackageVersion: revG, Feb-2011; Vcc range(V): 2.5 to 5.5; Mounting Technology: Surface Mount; ComponentLink2Description: Package Specification; ComponentLink1Description: Datasheet; Reset Input: No; DatasheetVersion: SCPS121D; ComponentLink1URL: http://www.ti.com/general/docs/lit/getliterature.tsp?genericPartNumber=PCF8575&fileType=pdf; Eco-Plan: Green (RoHS & no Sb/Br); PackageDescription: 24-Pin Thin Small Outline Package 0.65 mm Pitch; Push-Pull I/O Type: Yes; PartNumber: PCF8575PWR; PackageReference: PW0024A
L1 = CMP-006-00023-1: 6.8 ÂµH Shielded Molded Inductor 5 A 50mOhm Max Nonstandard; MF: Laird-Signal Integrity Products; SnapEDA_Link: https://www.snapeda.com/parts/MGAH06036R8M-10/Laird/view-part/?ref=snap; Price: None; Availability: In Stock; Pins: 2; Design Item ID: MGAH06036R8M-10; Check_prices: https://www.snapeda.com/parts/MGAH06036R8M-10/Laird/view-part/?ref=eda; Component Type: Standard; Case/Package: None; Purchase-URL: https://pricing.snapeda.com/search/part/MGAH06036R8M-10/?ref=eda; MP: MGAH06036R8M-10; Source: MGAH06036R8M-10.SchLib
LCD = CMP-008-000000-1: Display Development Tools 16x2 Black on Green Char LCD w Backlight; MF: Gravitech; MP: LCD-16X2; Pin Count: 16; Package: None; SnapEDA_Link: https://www.snapeda.com/parts/LCD-16X2/Gravitech/view-part/?ref=snap; Design Item ID: LCD-16X2; Source: LCD-16X2.SchLib; Check_prices: https://www.snapeda.com/parts/LCD-16X2/Gravitech/view-part/?ref=eda; Component Type: Standard; Value: *
MicroSD = CMP-11597-000006-1: CONN MICRO SD R/A PUSH-PUSH SMD; Contact Resistance: 100mR; Insulation Resistance: 1GR; Gender: Receptacle; Max Voltage Rating (AC): 125V; Pitch: 1.1mm; Mating Cycles: 10000; Max Current Rating: 500mA; Connector Type: Connector; Number of Contacts: 8; Housing Material: Polymer; Flammability Rating: UL94 V-0; REACH SVHC: No SVHC; Lead Free: Lead Free; Package Quantity: 400; Length: 13.85mm; Number of Rows: 2; Series: DM3; Min Operating Temperature: -25°C; Voltage Rating (AC): 125V; Contact Material: Copper Alloy; Depth: 15.95mm; Contact Plating: Gold; Packaging: Tape and Reel; Width: 13.85mm; Orientation: Right Angle; Color: Black; Voltage Rating: 125V; Radiation Hardening: No; Termination: Solder; Current Rating: 500mA; Mount: Surface Mount; Max Operating Temperature: 85°C
MOSFET_CC = CMP-32901-000488-1: MOSFET N-CH 55V 47A TO220AB; Turn-On Delay Time: 11ns; Gate to Source Voltage (Vgs): 16V; Element Configuration: Single; Rds On Max: 22mR; Turn-Off Delay Time: 26ns; Max Power Dissipation: 110W; Threshold Voltage: 2V; Drain to Source Resistance: 35mR; Input Capacitance: 1.7nF; Continuous Drain Current (ID): 47A; Case/Package: TO-220; Lead Free: Lead Free; Halogen Free: Halogen Free; Packaging: Rail/Tube; Length: 0.414inch; Min Operating Temperature: -55°C; REACH SVHC: No SVHC; Number of Pins: 3; Width: 0.185inch; Drain to Source Voltage (Vdss): 55V; Power Dissipation: 110W; RoHS Compliant: Yes; Max Operating Temperature: 175°C; Height: 0.6inch; Max Dual Supply Voltage: 55V; Drain to Source Breakdown Voltage: 55V; Mount: Through Hole
MUX = CMP-04892-000038-1: IC MUX/DEMUX 1X16 24SSOP; Supply Type: Single; High Level Output Current: 25mA; Min Supply Voltage: 2V; Number of Circuits: 16; Max Supply Voltage: 6V; Number of Channels: 1; Turn-On Delay Time: 300ns; Max Supply Current: 8uA; Bandwidth: 89MHz; Turn-Off Delay Time: 290ns; Propagation Delay: 75ns; Logic Function: Multiplexer; On-State Resistance: 160R; Polarity: Non-Inverting; Width: 5.3mm; Case/Package: SSOP; Max Operating Temperature: 125°C; Mount: Surface Mount; Min Operating Temperature: -55°C; REACH SVHC: No SVHC; Contact Plating: Gold; Max Output Current: 25mA; Weight: 0.006081oz; Height: 1.95mm; Package Quantity: 2000; Length: 8.2mm; Lead Free: Lead Free; Operating Supply Current: 8uA; Packaging: Tape and Reel; Series: 74HC; Low Level Output Current: 25mA; Number of Outputs: 1; Termination: SMD/SMT; Number of Inputs: 16; Number of Bits: 16; Radiation Hardening: No; Number of Pins: 24
NTC = CMP-06022-001050-1: Thermistor NTC 10kΩ ±1% 2-Pin Radial Bulk; Resistance: 10kR; Max Power Dissipation: 7.5mW; Lead Diameter: 0.4mm; RoHS Compliant: Yes; Number of Pins: 2; Lead Free: Lead Free; Height: 2mm; Lead Pitch: 2.5mm; Power Rating: 7.5mW; Series: NXR; Packaging: Bulk; Package Quantity: 500; Width: 4mm; Max Operating Temperature: 125°C; Termination: Radial; Min Operating Temperature: -40°C; Tolerance: 1%; Resistance Tolerance: 1%; Length: 5mm; Mount: Through Hole
OA_CC_SINK OA_UB_1 = CMP-014-00004-1: Dual, 16V, 11MHz, rail-to-rail input and output low-offset-voltage low-noise operational amplifier; MF: Texas Instruments; SnapEDA_Link: https://www.snapeda.com/parts/TLV9162IDDFR/Texas+Instruments/view-part/?ref=snap; Case/Package: SOT-23-THN-8 Texas Instruments; Component Type: Standard; Design Item ID: TLV9162IDDFR; MP: TLV9162IDDFR; Pins: 8; Source: TLV9162IDDFR.SchLib; Check_prices: https://www.snapeda.com/parts/TLV9162IDDFR/Texas+Instruments/view-part/?ref=eda; Value: *
OA_I_SENSE OA_UB_2 = CMP-0187-00480-3: None; Number of Channels: 1; Max Supply Voltage: 6V; Slew Rate: 0.6V/µs; Common Mode Rejection Ratio: 60dB; Gain Bandwidth Product: 1MHz; Amplifier Type: GENERAL PURPOSE; Power Supply Rejection Ratio (PSRR): 86dB; Supply Current: 100uA; Voltage Gain: 112dB; Input Bias Current: 1pA; Output Current: 23mA; Min Supply Voltage: 1.8V; Operating Supply Voltage: 5.5V; Input Offset Voltage-Max: 4.5mV; REACH SVHC: No SVHC; Number of Amplifiers: 1; Max Operating Temperature: 125°C; RoHS Compliant: Yes; Min Operating Temperature: -40°C; Number of Elements: 1; Slew Rate-Nom: 0.6V/µs; Mount: Surface Mount; Package Quantity: 3000; Number of Circuits: 1; Lead Free: Lead Free; Height: 1.3mm; Number of Pins: 5; Nominal Supply Current: 100uA; Radiation Hardening: No; Length: 3.1mm; Width: 1.8mm; Packaging: Tape and Reel; Unity Gain Bandwidth Product: 1MHz; Case/Package: SOT-23; Bandwidth: 1MHz; Input Offset Voltage (Vos): 4.5mV; Technology: CMOS
R1 = CMP-1011-00082-1: 2K2 0.063W 5% 0402 (1005 Metric)  SMD; Value: 2200.00 Ohm; Case-EIA: 0402; Case-Metric: 1005; Tolerance: 5 %; Power: 0.063 W; Technology: SMT
R2 = CMP-1018-00077-1: 1K3 1W 5% 2512 (6432 Metric)  SMD; Case-Metric: 6432; Case-EIA: 2512; Value: 1300.00 Ohm; Power: 1 W; Tolerance: 5 %; Technology: SMT
R3 R4 = CMP-03211-001268-1: RES SMD 10.7KΩ 0.1% 1/16W 0603; Manufacturer: TE Connectivity; Voltage Rating: 50V; Power Rating: 0.063W; Temperature Coefficient: 25ppm/°C; Device Class L2: Resistors; Tolerance: 0.1%; ComponentLink2URL: https://www.te.com/commerce/DocumentDelivery/DDEController?Action=showdoc&DocId=Data+Sheet%7F1773200%7FM%7Fpdf%7FEnglish%7FENG_DS_1773200_M.pdf%7F3-1676481-2; Temperature: -55°C to +155°C; RoHS: TRUE; octopart_url: https://octopart.com/cpf0603b10k7e-te+connectivity-22739310; Manufacturer Part Number: CPF0603B10K7E; Temperature Range Low: -55°C; Device Class L3: Chip SMD Resistors; Value: 10.7KΩ; Composition: Thin Film; Height: 0.55mm; Octopart: https://octopart.com/cpf0603b10k7e-te+connectivity-22739310; Category: Res; Series: CPF; ComponentLink2Description: Datasheet; Device Class L1: Passive Components; Ipc Land Pattern Name: RESC15580X45; Resistance: 10.7KΩ; Package: CPF0603; Automotive: No; Lead Free: Yes; Temperature Range High: +155°C; packaging: 5k Reel
R5 R8 = CMP-009-00030-5: Chip Resistor, 4.7 KOhm, +/- 1%, 0.1 W, -55 to 155 degC, 0402 (1005 Metric); Power: 100mW; Voltage Rating: 50V; Mounting Technology: SM; RoHS Compliant: True; Tolerance: 1%; Min Operating Temperature: -55°C; Max Operating Temperature: 155°C; Case/Package: 0402; Pins: 2
R6 = CMP-1013-00818-1: 523K 0.125W 1% 0805 (2012 Metric)  SMD; Case-Metric: 2012; Value: 523000.00 Ohm; Case-EIA: 0805; Tolerance: 1 %; Power: 0.125 W; Technology: SMT
R7 = CMP-2005-00644-1: Manufacturer: Vishay Dale; Part Number: CRCW1210220RJNTA
R9 R11 R12 = CMP-03412-040683-1: RES 10kΩ 5.00% 0.2W 0603
R10 = CMP-1017-00609-1: 7K5 0.75W 1% 2010 (5025 Metric)  SMD; Value: 7500.00 Ohm; Case-EIA: 2010; Case-Metric: 5025; Technology: SMT; Power: 0.75 W; Tolerance: 1 %
R13 R15 = CMP-26527-003782-1: 100Ω ±1% 0.5W 1206 High Power Anti-Sulfur Thin Film Chip Resistor; Max Power Dissipation: 500mW; Temperature Coefficient: 100ppm/°C; Resistance: 100R; Length: 0.122inch; Radiation Hardening: No; Contact Plating: Tin; Case/Package: 1206; Tolerance: 1%; Case Code (Metric): 3216; Resistor Type: Thin Film; Max Operating Temperature: 155°C; RoHS Compliant: Yes; Number of Terminations: 2; Width: 0.059inch; Packaging: Tape and Reel; Min Operating Temperature: -55°C; Features: Moisture Resistant; Height: 0.024inch; Mount: Surface Mount; Case Code (Imperial): 1206; Series: RNCP
R14 = CMP-02407-007524-1: RES Thick Film, 18kΩ, 1%, 1W, 100ppm/°C, 2512; Resistance: 18000R; Voltage Rating (DC): 500V; Length: 6.3mm; Power Rating: 1W; Width: 3.15mm; Lead Free: Lead Free; Case/Package: 2512; Height: 600um; Packaging: Tape and Reel; Tolerance: 1%
R16 = CMP-1011-00624-1: 10K2 0.063W 1% 0402 (1005 Metric)  SMD; Value: 10200.00 Ohm; Case-EIA: 0402; Case-Metric: 1005; Technology: SMT; Power: 0.063 W; Tolerance: 1 %
R17 = CMP-04015-046600-1: 2kΩ ±1% 0.063W, 1/16W Chip Resistor 0402 (1005 Metric) Moisture Resistant Thin Film
R18 = CMP-1016-00498-1: 1K2 0.75W 1% 1812 (4532 Metric)  SMD; Case-Metric: 4532; Case-EIA: 1812; Value: 1200.00 Ohm; Power: 0.75 W; Technology: SMT; Tolerance: 1 %
R19 = CMP-2005-00658-1: Manufacturer: Vishay Dale; Part Number: CRCW1210120RJNTA
RELAY_1-RELAY_10 = CMP-08822-000152-1: RELAY GEN PURPOSE SPST 10A 5V; Coil Resistance: 63R; Power Rating: 400mW; Max Voltage Rating (AC): 250V; Release Time: 5ms; Max Voltage Rating (DC): 125V; Coil Current: 79.4mA; Coil Type: Non-Latching; Operate Time: 10ms; Relay Type: General Purpose; Coil Voltage (DC): 5V; RoHS Compliant: Yes; Power Consumption: 400mW; Package Quantity: 500; Max Operating Temperature: 85°C; Termination: Solder; Length: 22.5mm; Packaging: Tray; Number of Pins: 4; Max Current Rating: 10A; Mount: Through Hole; Height: 19mm; Throw Configuration: SPST; Min Operating Temperature: -40°C; Coil Power: 400mW; Contact Material: Tin; Contact Current Rating: 10A; Weight: 12g; Lead Free: Lead Free; Width: 16.5mm
RELAY_DRIVER_1 RELAY_DRIVER_2 = CMP-04912-000075-1: MOSFET 7CH 16SOIC; Power Dissipation: 860mW; Output Current: 140mA; Collector Emitter Voltage (VCEO): 20V; Collector Emitter Saturation Voltage: 750mV; Output Voltage: 16V; Number of Drivers: 7; Number of Pins: 16; RoHS Compliant: Yes; Height: 1.5mm; Package Quantity: 1; REACH SVHC: No SVHC; Series: -; Min Operating Temperature: -40°C; Max Power Dissipation: 860mW; Max Collector Current: 140mA; Mount: Surface Mount; Packaging: Tape and Reel; Radiation Hardening: No; Case/Package: SOIC; Max Operating Temperature: 85°C; Number of Outputs: 7; Lead Free: Lead Free; Width: 4mm; Weight: 0.004998oz; Length: 10mm
RPU1-RPU10 = CMP-009-00030-5: Chip Resistor, 4.7 KOhm, +/- 1%, 0.1 W, -55 to 155 degC, 0402 (1005 Metric); Value: 4.7k; Voltage Rating: 50V; Power: 100mW; Tolerance: 1%; Mounting Technology: SM; RoHS Compliant: True; Min Operating Temperature: -55°C; Max Operating Temperature: 155°C; Case/Package: 0402; Pins: 2
SHUNT = CMP-07231-007405-1: RES 0.05 OHM 1% 3W 2512
SPI = CMP-1024-00383-1: 0.025" SQ Post Header, Through-hole, Vertical, -55 to 125 degC, 2.54 mm Pitch, 6-Pin, Male, RoHS; Manufacturer: Samtec; Pitch: 2.54 mm; RoHS: True; ComponentLink1Description: Manufacturer URL; DatasheetVersion: F-214; Orientation: Vertical; ComponentLink1URL: http://www.samtec.com; ComponentLink3Description: Package Specification; ComponentLink2Description: Datasheet; PackageVersion: DM, 8/1988; PackageDescription: .025[0.64] SQ. Post Terminal Strip Assembly; PackageReference: TSW-106-07-X-S; Mounting Technology: Through-hole; Temperature Range: -55 to 125 degC; ComponentLink3URL: http://www.samtec.com/documents/webfiles/cpdf/TSW-XXX-XX-XXX-X-XX-XXX-MKT.pdf; ComponentLink2URL: http://www.samtec.com/documents/webfiles/pdf/TSW_TH.PDF; PartNumber: TSW-106-07-G-S
USB_-_C_IN = CMP-245163-000004-1: CONN RCPT TYPE C 6P SMD RA
XT60 = CMP-002-00073-1: Plug; DC supply; XT60; male; PIN: 2; for cable; soldered; 30A; 500V; MF: AMASS; Design Item ID: XT60-M; Component Type: Standard; Case/Package: Package; MP: XT60-M; Value: *; Pins: 2; Check_prices: https://www.snapeda.com/parts/XT60-M/AMASS/view-part/?ref=eda; Source: XT60-M.SchLib; SnapEDA_Link: https://www.snapeda.com/parts/XT60-M/AMASS/view-part/?ref=snap